# EAGLE design AMP 2.0 Power Supply (EAGLE 6.5.0)
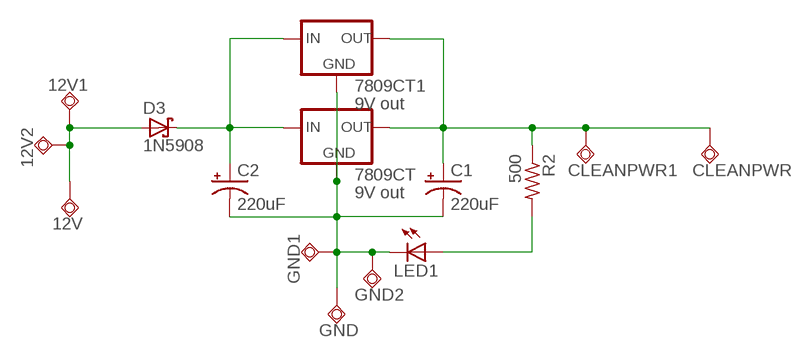
[diagram p0: schematic, sheet 1]

## Parts
12V  TPSQPAD1-20  [P1-20]
12V1  TPSQPAD1-20  [P1-20]
12V2  TPSQPAD1-20  [P1-20]
7809CT  9V out  78XXS  [78XXS]
7809CT1  9V out  78XXS  [78XXS]
C1  220uF  CPOL-USB45181C  [B45181C]
C2  220uF  CPOL-USB45181C  [B45181C]
CLEANPWR  TPSQPAD1-20  [P1-20]
CLEANPWR1  TPSQPAD1-20  [P1-20]
D3  1N5908  [C4111-15]
GND  TPSQPAD1-20  [P1-20]
GND1  TPSQPAD1-20  [P1-20]
GND2  TPSQPAD1-20  [P1-20]
LED1  LED5MM  [LED5MM]
R2  500  R-US_0204/7  [0204/7]

## Nets
BUFFEREDDIRTY [Power]: 7809CT1.IN 7809CT.IN C2.+ D3.C
CLEAN9V [Cleanpower]: 7809CT1.OUT 7809CT.OUT C1.+ CLEANPWR1.TP CLEANPWR.TP R2.1
N$1 [Power]: 7809CT1.GND 7809CT.GND C1.- C2.- GND1.TP GND2.TP GND.TP LED1.K(C)
N$3 [Power]: 12V1.TP 12V2.TP 12V.TP D3.A
N$10: LED1.A R2.2

## Library data of the parts
12V 12V1 12V2 CLEANPWR CLEANPWR1 GND GND1 GND2 = testpad:TPSQ: Test pad
7809CT 7809CT1 = v-reg:78XXS: VOLTAGE REGULATOR
C1 C2 = rcl:CPOL-US: POLARIZED CAPACITOR, American symbol
D3 = diode:1N5908: DIODE schottky
LED1 = led:LED: LED OSRAM: - CHIPLED LG R971, LG N971, LY N971, LG Q971, LY Q971, LO R971, LY R971 LH N974, LH R974 LS Q976, LO Q976, LY Q976 LO Q996 - Hyper CHIPLED LW Q18S LB Q993, LB Q99A, LB R99A - SideLED LS A670, LO A670, LY A670, LG A670, LP A670 LB A673, LV A673, LT A673, LW A673 LH A674 LY A675 LS A676, LA A676, LO A676, LY A676, LW A676 LS A679, LY A679, LG A679 - Hyper Micro SIDELED® LS Y876, LA Y876, LO Y876, LY Y876 LT Y87S - SmartLED LW L88C, LW L88S LB L89C, LB L89S, LG L890 LS L89K, LO L89K, LY L89K LS L896, LA L896, LO L896, LY L896 - TOPLED LS T670, LO T670, LY T670, LG T670, LP T670 LSG T670, LSP T670, LSY T670, LOP T670, LYG T670 LG T671, LOG T671, LSG T671 LB T673, LV T673, LT T673, LW T673 LH T674 LS T676, LA T676, LO T676, LY T676, LB T676, LH T676, LSB T676, LW T676 LB T67C, LV T67C, LT T67C, LS T67K, LO T67K, LY T67K, LW E67C LS E67B, LA E67B, LO E67B, LY E67B, LB E67C, LV E67C, LT E67C LW T67C LS T679, LY T679, LG T679 LS T770, LO T770, LY T770, LG T770, LP T770 LB T773, LV T773, LT T773, LW T773 LH T774 LS E675, LA E675, LY E675, LS T675 LS T776, LA T776, LO T776, LY T776, LB T776 LHGB T686 LT T68C, LB T68C - Hyper Mini TOPLED® LB M676 - Mini TOPLED Santana® LG M470 LS M47K, LO M47K, LY M47K Source: http://www.osram.convergy.de LUXEON: - LUMILED® LXK2-PW12-R00, LXK2-PW12-S00, LXK2-PW14-U00, LXK2-PW14-V00 LXK2-PM12-R00, LXK2-PM12-S00, LXK2-PM14-U00 LXK2-PE12-Q00, LXK2-PE12-R00, LXK2-PE12-S00, LXK2-PE14-T00, LXK2-PE14-U00 LXK2-PB12-K00, LXK2-PB12-L00, LXK2-PB12-M00, LXK2-PB14-N00, LXK2-PB14-P00, LXK2-PB14-Q00 LXK2-PR12-L00, LXK2-PR12-M00, LXK2-PR14-Q00, LXK2-PR14-R00 LXK2-PD12-Q00, LXK2-PD12-R00, LXK2-PD12-S00 LXK2-PH12-R00, LXK2-PH12-S00 LXK2-PL12-P00, LXK2-PL12-Q00, LXK2-PL12-R00 Source: www.luxeon.com KINGBRIGHT: KA-3528ASYC Source: www.kingbright.com
R2 = rcl:R-US_: RESISTOR, American symbol

## Net classes
0 Signal: width 0.61 mm, clearance 0.762 mm
1 Power: width 1.27 mm, clearance 0.762 mm
2 Cleanpower: width 0.61 mm, clearance 0.762 mm

## Board
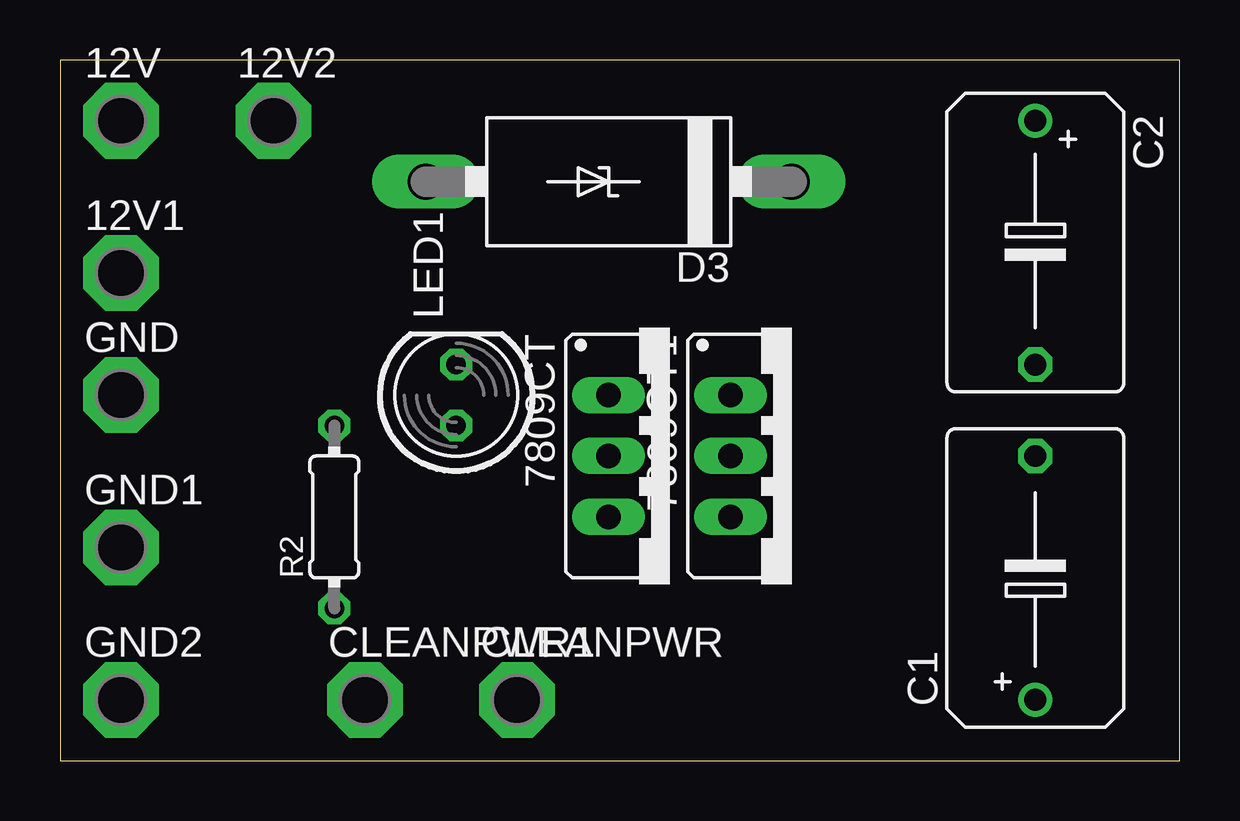
[diagram p1: board, top side]
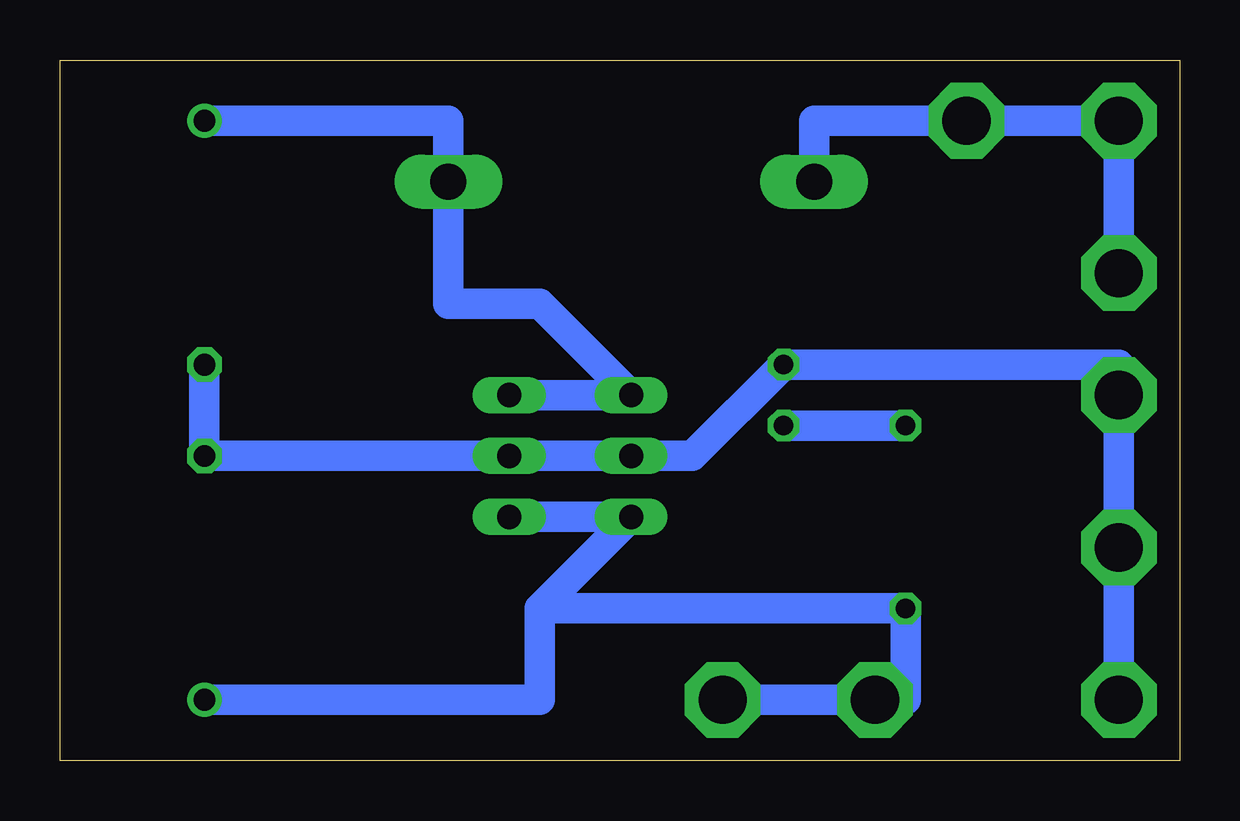
[diagram p2: board, bottom side, seen from below]

Size 46.66 x 29.2 mm. Coordinates in mm from the lower left corner, seen from the top.
Outline: 0,0 46.66,0 46.66,29.2 0,29.2 0,0
Copper layers (1*16): Top 0.035mm / dielectric 1.5mm / Bottom 0.035mm
Design rules "default": minimum track width 10mil, minimum drill 24mil, track to track 8mil, track to pad 8mil, pad to pad 8mil, via to via 8mil, smd to smd 8mil, copper to edge 40mil, drill to drill 8mil, minimum pad ring 10mil, minimum via ring 8mil, stop-mask expansion 4mil, vias tented up to drill 0mil, thermal gap 10mil

### Footprints (pad centres in the part's own frame; a part is rotated, then mirrored left to right if it is on the bottom)
P1-20 = drill 2.007 pad 3.15 octagon: TP 0,0
78XXS = drill 1.016 long: GND 0,-2.54; IN -2.54,-2.54; OUT 2.54,-2.54
B45181C = drill 0.914: + -5.08,0 | drill 0.914 octagon: - 5.08,0
C4111-15 = drill 1.499 long: A 7.62,0; C -7.62,0
LED5MM = drill 0.813 octagon: A -1.27,0; K 1.27,0
0204/7 = drill 0.813 octagon: 1 -3.81,0; 2 3.81,0

### Placement (x,y rotation side)
12V  2.54,26.67 0 top
12V1  2.54,20.32 0 top
12V2  8.89,26.67 0 top
7809CT  25.4,12.7 270 top
7809CT1  30.48,12.7 270 top
C1  40.64,7.62 90 top
C2  40.64,21.59 270 top
CLEANPWR  19.05,2.54 0 top
CLEANPWR1  12.7,2.54 0 top
D3  22.86,24.13 180 top
GND  2.54,15.24 0 top
GND1  2.54,8.89 0 top
GND2  2.54,2.54 0 top
LED1  16.51,15.24 90 top
R2  11.43,10.16 90 top

### Tracks (layer width: path | path; a pad name or v marks a point on that pad's centre or on a via)
BUFFEREDDIRTY
  Bottom 1.27: C2.+ 30.48,26.67 D3.C 30.48,19.05 26.67,19.05 7809CT.IN 7809CT1.IN
CLEAN9V
  Bottom 1.27: 26.67,6.35 7809CT.OUT 7809CT1.OUT | 26.67,6.35 26.67,2.54 C1.+ | 26.67,6.35 R2.1 11.43,2.54 CLEANPWR1.TP CLEANPWR.TP
N$1
  Bottom 1.27: C2.- C1.- 7809CT1.GND 7809CT.GND 20.32,12.7 LED1.K 2.54,16.51 GND.TP GND1.TP GND2.TP
N$3
  Bottom 1.27: 12V1.TP 12V.TP 12V2.TP 15.24,26.67 D3.A
N$10
  Bottom 1.27: R2.2 LED1.A